# Altium project 计算机原理实验4.PrjPCB
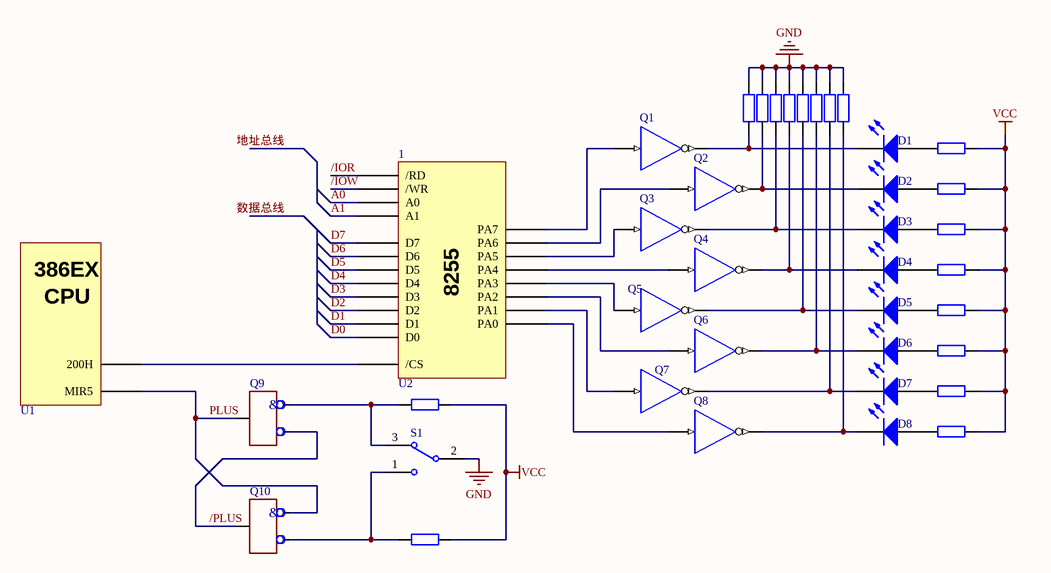
[diagram p0: 计算机原理实验4.SchDoc]
1 sheet, 39 parts. Net scope: global (net labels, ports and power ports of the same name join across sheets).

## Sheet 计算机原理实验4.SchDoc
size A4

### Parts
1  U2
?  U1
D1  LED0  [LED-0]  (value not drawn)
D2  LED0  [LED-0]  (value not drawn)
D3  LED0  [LED-0]  (value not drawn)
D4  LED0  [LED-0]  (value not drawn)
D5  LED0  [LED-0]  (value not drawn)
D6  LED0  [LED-0]  (value not drawn)
D7  LED0  [LED-0]  (value not drawn)
D8  LED0  [LED-0]  (value not drawn)
Q1  NOT  (value not drawn)
Q2  NOT  (value not drawn)
Q3  NOT  (value not drawn)
Q4  NOT  (value not drawn)
Q5  NOT  (value not drawn)
Q6  NOT  (value not drawn)
Q7  NOT  (value not drawn)
Q8  NOT  (value not drawn)
Q9  AND2NOT  (value not drawn)
Q10  AND2NOT  (value not drawn)
R1  Res2  [AXIAL-0.4]  (value not drawn)
R2  Res2  [AXIAL-0.4]  (value not drawn)
R3  Res2  [AXIAL-0.4]  (value not drawn)
R4  Res2  [AXIAL-0.4]  (value not drawn)
R5  Res2  [AXIAL-0.4]  (value not drawn)
R6  Res2  [AXIAL-0.4]  (value not drawn)
R7  Res2  [AXIAL-0.4]  (value not drawn)
R8  Res2  [AXIAL-0.4]  (value not drawn)
R9  Res2  [AXIAL-0.4]  (value not drawn)
R10  Res2  [AXIAL-0.4]  (value not drawn)
R11  Res2  [AXIAL-0.4]  (value not drawn)
R12  Res2  [AXIAL-0.4]  (value not drawn)
R13  Res2  [AXIAL-0.4]  (value not drawn)
R14  Res2  [AXIAL-0.4]  (value not drawn)
R15  Res2  [AXIAL-0.4]  (value not drawn)
R16  Res2  [AXIAL-0.4]  (value not drawn)
R17  Res2  [AXIAL-0.4]  (value not drawn)
R18  Res2  [AXIAL-0.4]  (value not drawn)
S1  SW-SPDT  [TL36WW15050]  (value not drawn)

### Nets
GND: R1.2 R2.2 R3.2 R4.2 R5.2 R6.2 R7.2 R8.2 S1.2
VCC: R9.1 R10.1 R11.1 R12.1 R13.1 R14.1 R15.1 R16.2 R17.1 R18.2
/IOR: 1.GND(/RD)
/IOW: 1.GND(/WR)
/PLUS: Q9.6 Q10.4
A0: 1.GND(A0)
A1: 1.GND(A1)
D0: 1.GND(D0)
D1: 1.GND(D1)
D2: 1.GND(D2)
D3: 1.GND(D3)
D4: 1.GND(D4)
D5: 1.GND(D5)
D6: 1.GND(D6)
D7: 1.GND(D7)
PLUS: ?.GND(MIR5) Q9.4 Q10.5
Net1_GND: 1.GND(/CS) ?.GND(200H)
Net1_GND: 1.GND(PA2) Q6.1(A)  [a separate net that carries the same name]
Net1_GND: 1.GND(PA1) Q7.1(A)  [a separate net that carries the same name]
Net1_GND: 1.GND(PA0) Q8.1(A)  [a separate net that carries the same name]
Net1_GND: 1.GND(PA7) Q1.1(A)  [a separate net that carries the same name]
Net1_GND: 1.GND(PA6) Q2.1(A)  [a separate net that carries the same name]
Net1_GND: 1.GND(PA5) Q3.1(A)  [a separate net that carries the same name]
Net1_GND: 1.GND(PA4) Q4.1(A)  [a separate net that carries the same name]
Net1_GND: 1.GND(PA3) Q5.1(A)  [a separate net that carries the same name]
NetD1_1: D1.1(A) R9.2
NetD1_2: D1.2(K) Q1.2(Y) R1.1
NetD2_1: D2.1(A) R10.2
NetD2_2: D2.2(K) Q2.2(Y) R2.1
NetD3_1: D3.1(A) R11.2
NetD3_2: D3.2(K) Q3.2(Y) R3.1
NetD4_1: D4.1(A) R12.2
NetD4_2: D4.2(K) Q4.2(Y) R4.1
NetD5_1: D5.1(A) R13.2
NetD5_2: D5.2(K) Q5.2(Y) R5.1
NetD6_1: D6.1(A) R14.2
NetD6_2: D6.2(K) Q6.2(Y) R6.1
NetD7_1: D7.1(A) R15.2
NetD7_2: D7.2(K) Q7.2(Y) R7.1
NetD8_1: D8.1(A) R17.2
NetD8_2: D8.2(K) Q8.2(Y) R8.1
NetQ9_5: Q9.5 R16.1 S1.3
NetQ10_6: Q10.6 R18.1 S1.1

### Notes on the sheet
- Labels drawn without touching a wire or pin: 地址总线, 数据总线
- (in symbol 386EX) CPU
- (in symbol AND2NOT) &

### Library data of the parts
1 = 8255
? = 386EX
D1-D8 = LED0: Typical INFRARED GaAs LED; Published: 8-Jun-2000; LatestRevisionDate: 08-Jul-2005; LatestRevisionNote: Mech Layer 1 removed.; PackageReference: LED-0; Publisher: Altium Limited; PackageDescription: LED; 2 Leads
Q1-Q8 = NOT: Inverter
R1-R18 = Res2: Resistor; Value: 1K; Published: 8-Jun-2000; LatestRevisionDate: 17-Jul-2002; LatestRevisionNote: Re-released for DXP Platform.; PackageReference: AXIAL-0.4; Publisher: Altium Limited; PackageDescription: Axial Device, Thru-Hole; 2 Leads; 0.4 in Pin Spacing
S1 = SW-SPDT: SPDT Subminiature Toggle Switch, Right Angle Mounting, Vertical Actuation; Published: 24-Mar-1999; LatestRevisionDate: 17-Dec-2003; LatestRevisionNote: Schematic revised, PCB Footprint replaced.; DatasheetVersion: 05-Dec-2000; PackageReference: TL36WW15050; Publisher: Altium Limited; PackageDescription: Switch; 4 Leads; ComponentLink1Description: Manufacturer Link; ComponentLink1URL: http://www.apem.com